# Altium schematic sheet PrototipoBotaoSchDoc.SchDoc
size A4; SheetNumber: 1; SheetTotal: 2
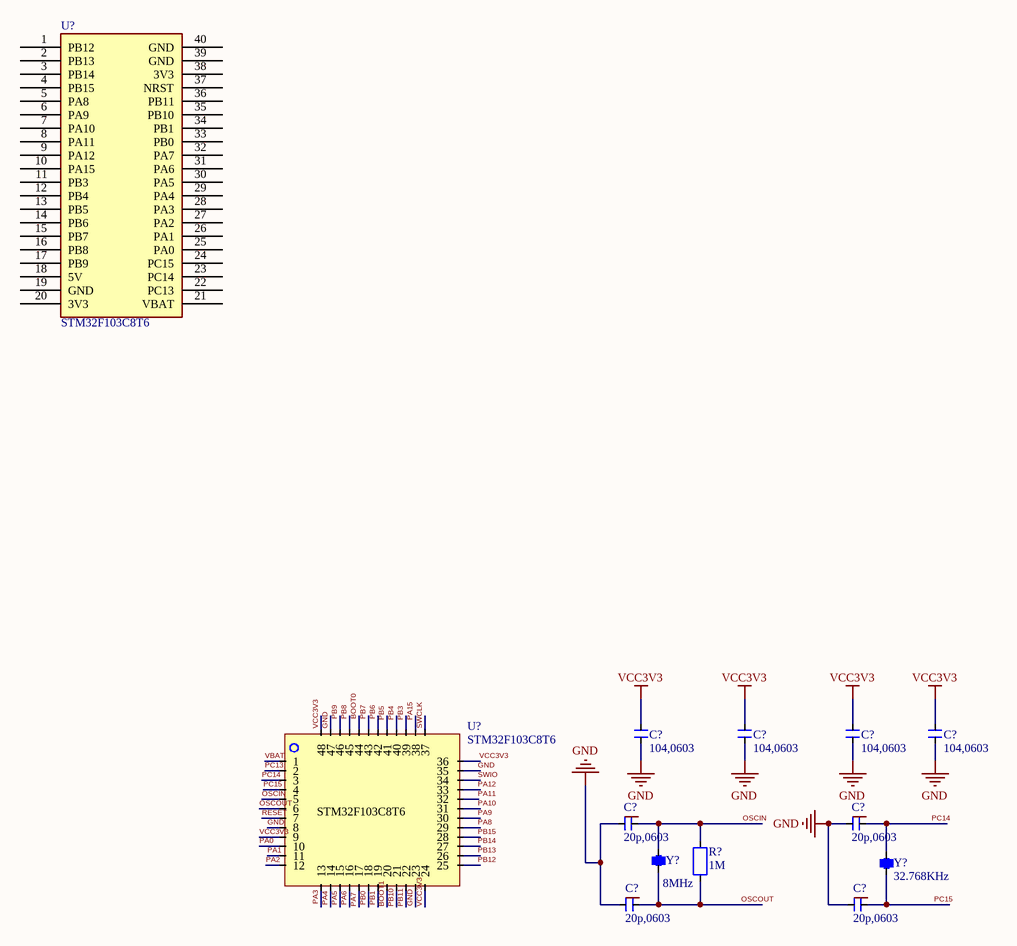
[diagram p0: PrototipoBotaoSchDoc.SchDoc]

## Parts
(Parts that share a designator on the sheet are numbered #1, #2 ... from top to bottom, then left to right.)
C?#1  104,0603
C?#2  104,0603
C?#3  104,0603
C?#4  104,0603  [C0603]
C?#5  20p,0603  [C0603]
C?#6  20p,0603  [C0603]
C?#7  20p,0603  [C0603]
C?#8  20p,0603  [C0603]
R?  1M  [R0603]
U?#1  STM32F103C8T6  [Stm32 BluePill]
U?#2  STM32F103C8T6  [STM32F103C8T6]
Y?#1  8MHz
Y?#2  32.768KHz

## Nets
GND: C?#1.2 C?#2.2 C?#3.2 C?#4.2 C?#5.2 C?#6.2 C?#7.2 C?#8.2 U?#2.8 U?#2.23 U?#2.35 U?#2.47
VCC3V3: C?#1.1 C?#2.1 C?#3.1 C?#4.1 U?#2.9 U?#2.24 U?#2.36 U?#2.48
BOOT0: U?#2.44
BOOT1: U?#2.20
OSCIN: C?#5.1 R?.2 U?#2.5 Y?#1.1
OSCOUT: C?#7.1 R?.1 U?#2.6 Y?#1.2
PA0: U?#2.10
PA1: U?#2.11
PA2: U?#2.12
PA3: U?#2.13
PA4: U?#2.14
PA5: U?#2.15
PA6: U?#2.16
PA7: U?#2.17
PA8: U?#2.29
PA9: U?#2.30
PA10: U?#2.31
PA11: U?#2.32
PA12: U?#2.33
PA15: U?#2.38
PB0: U?#2.18
PB1: U?#2.19
PB3: U?#2.39
PB4: U?#2.40
PB5: U?#2.41
PB6: U?#2.42
PB7: U?#2.43
PB8: U?#2.45
PB9: U?#2.46
PB10: U?#2.21
PB11: U?#2.22
PB12: U?#2.25
PB13: U?#2.26
PB14: U?#2.27
PB15: U?#2.28
PC13: U?#2.2
PC14: C?#6.1 U?#2.3 Y?#2.1
PC15: C?#8.1 U?#2.4 Y?#2.2
RESET: U?#2.7
SWCLK: U?#2.37
SWIO: U?#2.34
VBAT: U?#2.1

Not connected (* = marked no-connect by the designer): U?#1 1(PB12) 2(PB13) 3(PB14) 4(PB15) 5(PA8) 6(PA9) 7(PA10) 8(PA11) 9(PA12) 10(PA15) 11(PB3) 12(PB4) 13(PB5) 14(PB6) 15(PB7) 16(PB8) 17(PB9) 18(5V) 19(GND) 20(3V3) 21(VBAT) 22(PC13) 23(PC14) 24(PC15) 25(PA0) 26(PA1) 27(PA2) 28(PA3) 29(PA4) 30(PA5) 31(PA6) 32(PA7) 33(PB0) 34(PB1) 35(PB10) 36(PB11) 37(NRST) 38(3V3) 39(GND) 40(GND)

## Library data of the parts
C?#1-C?#4 = GRM033C71C104KE14D: 16V 100nF X7S ±10% 0201 Multilayer Ceramic Capacitors MLCC - SMD/SMT ROHS; Manufacturer: Murata; Manufacturer Lifecycle Status: IN PRODUCTION; Supplier 1: Avnet; Supplier Part Number 1: GRM033C71C104KE14D; Manufacturer Part Number: GRM033C71C104KE14D; RoHS: Compliant; Category: Ceramic Capacitors; Stock 1: 960000; Pricing 1: 15000=0,00312, 30000=0,00304, 60000=0,003, 90000=0,00294, 120000=0,00293 (USD); Capacitance: 100nF; Case/Package: 0201; Case Code (Imperial): 0201; Case Code (Metric): 0603; Dielectric: X7S; Dielectric Material: Ceramic; Height: 300µm; Length: 600µm; Lifecycle Status: Production; Material: Ceramic; Max Operating Temperature: 125°C; Min Operating Temperature: -55°C; Mount: Surface Mount; Number of Terminals: 2; Packaging: Digi-Reel®; REACH SVHC: Yes; Schedule B: 8532240020, 8532240020|8532240020, 8532240020|8532240020|8532240020, 8532240020|8532240020|8532240020|8532240020; Termination: SMD/SMT; Thickness: 300µm; Tolerance: 10%; Voltage Rating: 16V; Voltage Rating (DC): 16V; Weight: 340.194278µg; Width: 300µm; ComponentLink1URL: https://datasheet.octopart.com:443/GRM033C71C104KE14D-Murata-datasheet-178521774.pdf?src-supplier=Arrow.cn; ComponentLink1Description: https://datasheet.octopart.com:443/GRM033C71C104KE14D-Murata-datasheet-178521774.pdf?src-supplier=Arrow.cn; ComponentLink2URL: https://datasheet.octopart.com:443/GRM033C71C104KE14D-Murata-datasheet-150009099.pdf?src-supplier=Arrow.cn; ComponentLink2Description: https://datasheet.octopart.com:443/GRM033C71C104KE14D-Murata-datasheet-150009099.pdf?src-supplier=Arrow.cn; ComponentLink3URL: https://datasheet.octopart.com:443/GRM033C71C104KE14D-Murata-datasheet-165579666.pdf?src-supplier=TME; ComponentLink3Description: https://datasheet.octopart.com:443/GRM033C71C104KE14D-Murata-datasheet-165579666.pdf?src-supplier=TME; ComponentLink4URL: https://datasheet.octopart.com:443/GRM033C71C104KE14D-Murata-datasheet-141274204.pdf?src-supplier=Ciiva; ComponentLink4Description: https://datasheet.octopart.com:443/GRM033C71C104KE14D-Murata-datasheet-141274204.pdf?src-supplier=Ciiva; ComponentLink5URL: https://datasheet.octopart.com:443/GRM033C71C104KE14D-Murata-datasheet-140675366.pdf?src-supplier=Ciiva; ComponentLink5Description: https://datasheet.octopart.com:443/GRM033C71C104KE14D-Murata-datasheet-140675366.pdf?src-supplier=Ciiva; ComponentLink6URL: https://datasheet.octopart.com:443/GRM033C71C104KE14D-Murata-datasheet-138738157.pdf?src-supplier=Ciiva; ComponentLink6Description: https://datasheet.octopart.com:443/GRM033C71C104KE14D-Murata-datasheet-138738157.pdf?src-supplier=Ciiva; ComponentLink7URL: https://datasheet.octopart.com:443/GRM033C71C104KE14D-Murata-datasheet-22122223.pdf?src-supplier=Future+Electronics; ComponentLink7Description: https://datasheet.octopart.com:443/GRM033C71C104KE14D-Murata-datasheet-22122223.pdf?src-supplier=Future+Electronics; ComponentLink8URL: https://datasheet.octopart.com/GRM033C71C104KE14D-Murata-datasheet-12515295.pdf; ComponentLink8Description: https://datasheet.octopart.com/GRM033C71C104KE14D-Murata-datasheet-12515295.pdf; ComponentLink9URL: https://datasheet.octopart.com/GRM033C71C104KE14D-Murata-datasheet-12510076.pdf; ComponentLink9Description: https://datasheet.octopart.com/GRM033C71C104KE14D-Murata-datasheet-12510076.pdf; ComponentLink10URL: https://datasheet.octopart.com/GRM033C71C104KE14D-Murata-datasheet-11978611.pdf; ComponentLink10Description: https://datasheet.octopart.com/GRM033C71C104KE14D-Murata-datasheet-11978611.pdf; ComponentLink11URL: https://datasheet.octopart.com/GRM033C71C104KE14D-Murata-datasheet-10025737.pdf; ComponentLink11Description: https://datasheet.octopart.com/GRM033C71C104KE14D-Murata-datasheet-10025737.pdf; ComponentLink12URL: https://datasheet.octopart.com/GRM033C71C104KE14D-Murata-datasheet-8819587.pdf; ComponentLink12Description: https://datasheet.octopart.com/GRM033C71C104KE14D-Murata-datasheet-8819587.pdf; ComponentLink13URL: http://sigma.octopart.com:80/reach_statement/Murata-company-16.pdf?src-supplier=Compliance+Statements; ComponentLink13Description: http://sigma.octopart.com:80/reach_statement/Murata-company-16.pdf?src-supplier=Compliance+Statements
C?#5-C?#8 = Capacitor: Capacitor 0603; Manufacturer: Murata; Manufacturer Part Number: GRM033C71C104KE14D; Manufacturer Lifecycle Status: IN PRODUCTION; Capacitance: 100nF; Dielectric: X7S; Dielectric Material: Ceramic; Tolerance: 10%; Voltage Rating: 16V; Supplier 1: Avnet; Supplier Part Number 1: GRM033C71C104KE14D; RoHS: Compliant; Category: Ceramic Capacitors; Stock 1: 960000; Pricing 1: 15000=0,00312, 30000=0,00304, 60000=0,003, 90000=0,00294, 120000=0,00293 (USD); Case/Package: 0201; Case Code (Imperial): 0201; Case Code (Metric): 0603; Height: 300µm; Length: 600µm; Lifecycle Status: Production; Material: Ceramic; Max Operating Temperature: 125°C; Min Operating Temperature: -55°C; Mount: Surface Mount; Number of Terminals: 2; Packaging: Digi-Reel®; REACH SVHC: Yes; Schedule B: 8532240020, 8532240020|8532240020, 8532240020|8532240020|8532240020, 8532240020|8532240020|8532240020|8532240020; Termination: SMD/SMT; Thickness: 300µm; Voltage Rating (DC): 16V; Weight: 340.194278µg; Width: 300µm; ComponentLink1URL: https://datasheet.octopart.com:443/GRM033C71C104KE14D-Murata-datasheet-178521774.pdf?src-supplier=Arrow.cn; ComponentLink1Description: https://datasheet.octopart.com:443/GRM033C71C104KE14D-Murata-datasheet-178521774.pdf?src-supplier=Arrow.cn; ComponentLink2URL: https://datasheet.octopart.com:443/GRM033C71C104KE14D-Murata-datasheet-150009099.pdf?src-supplier=Arrow.cn; ComponentLink2Description: https://datasheet.octopart.com:443/GRM033C71C104KE14D-Murata-datasheet-150009099.pdf?src-supplier=Arrow.cn; ComponentLink3URL: https://datasheet.octopart.com:443/GRM033C71C104KE14D-Murata-datasheet-165579666.pdf?src-supplier=TME; ComponentLink3Description: https://datasheet.octopart.com:443/GRM033C71C104KE14D-Murata-datasheet-165579666.pdf?src-supplier=TME; ComponentLink4URL: https://datasheet.octopart.com:443/GRM033C71C104KE14D-Murata-datasheet-141274204.pdf?src-supplier=Ciiva; ComponentLink4Description: https://datasheet.octopart.com:443/GRM033C71C104KE14D-Murata-datasheet-141274204.pdf?src-supplier=Ciiva; ComponentLink5URL: https://datasheet.octopart.com:443/GRM033C71C104KE14D-Murata-datasheet-140675366.pdf?src-supplier=Ciiva; ComponentLink5Description: https://datasheet.octopart.com:443/GRM033C71C104KE14D-Murata-datasheet-140675366.pdf?src-supplier=Ciiva; ComponentLink6URL: https://datasheet.octopart.com:443/GRM033C71C104KE14D-Murata-datasheet-138738157.pdf?src-supplier=Ciiva; ComponentLink6Description: https://datasheet.octopart.com:443/GRM033C71C104KE14D-Murata-datasheet-138738157.pdf?src-supplier=Ciiva; ComponentLink7URL: https://datasheet.octopart.com:443/GRM033C71C104KE14D-Murata-datasheet-22122223.pdf?src-supplier=Future+Electronics; ComponentLink7Description: https://datasheet.octopart.com:443/GRM033C71C104KE14D-Murata-datasheet-22122223.pdf?src-supplier=Future+Electronics; ComponentLink8URL: https://datasheet.octopart.com/GRM033C71C104KE14D-Murata-datasheet-12515295.pdf; ComponentLink8Description: https://datasheet.octopart.com/GRM033C71C104KE14D-Murata-datasheet-12515295.pdf; ComponentLink9URL: https://datasheet.octopart.com/GRM033C71C104KE14D-Murata-datasheet-12510076.pdf; ComponentLink9Description: https://datasheet.octopart.com/GRM033C71C104KE14D-Murata-datasheet-12510076.pdf; ComponentLink10URL: https://datasheet.octopart.com/GRM033C71C104KE14D-Murata-datasheet-11978611.pdf; ComponentLink10Description: https://datasheet.octopart.com/GRM033C71C104KE14D-Murata-datasheet-11978611.pdf; ComponentLink11URL: https://datasheet.octopart.com/GRM033C71C104KE14D-Murata-datasheet-10025737.pdf; ComponentLink11Description: https://datasheet.octopart.com/GRM033C71C104KE14D-Murata-datasheet-10025737.pdf; ComponentLink12URL: https://datasheet.octopart.com/GRM033C71C104KE14D-Murata-datasheet-8819587.pdf; ComponentLink12Description: https://datasheet.octopart.com/GRM033C71C104KE14D-Murata-datasheet-8819587.pdf; ComponentLink13URL: http://sigma.octopart.com:80/reach_statement/Murata-company-16.pdf?src-supplier=Compliance+Statements; ComponentLink13Description: http://sigma.octopart.com:80/reach_statement/Murata-company-16.pdf?src-supplier=Compliance+Statements
R? = Resistor: Resistor 0603; Manufacturer: Vishay; Manufacturer Part Number: CRCW060347K0FKEAHP; Max Power Dissipation: 250mW; Power Dissipation: 330mW; Resistance: 47kΩ; Temperature Coefficient: 100ppm/°C; Tolerance: 1%; Voltage Rating: 75V; Supplier 1: Avnet; Supplier Part Number 1: CRCW060347K0FKEAHP; RoHS: Compliant; Category: Chip SMD Resistors; Stock 1: 40000; Pricing 1: 5000=0,01375, 10000=0,01363, 20000=0,01248, 30000=0,01226, 40000=0,01205 (USD); Case/Package: 0603; Case Code (Imperial): 0603; Case Code (Metric): 1608; China RoHS: Non-Compliant; Composition: Thick Film; Contact Plating: Tin; Depth: 850µm; Features: Automotive AEC-Q200; Height: 450µm; Lead Free: Lead Free; Length: 1.6mm; Lifecycle Status: Production; Max Operating Temperature: 155°C; Military Standard: Not; Min Operating Temperature: -55°C; Mount: Surface Mount; Number of Pins: 2; Number of Terminals: 2; Number of Terminations: 2; Packaging: Cut Tape; Power Rating: 330mW; Radiation Hardening: No; REACH SVHC: Yes; Schedule B: 8533210045, 8533210045|8533210045, 8533210045|8533210045|8533210045, 8533210045|8533210045|8533210045|8533210045; Termination: SMD/SMT; Voltage Rating (DC): 75V; Weight: 2.012816mg; Width: 850µm; Working Voltage: 75V; ComponentLink1URL: https://datasheet.octopart.com:443/CRCW060347K0FKEAHP-Vishay-datasheet-13148866.pdf?src-supplier=Upverter; ComponentLink1Description: https://datasheet.octopart.com:443/CRCW060347K0FKEAHP-Vishay-datasheet-13148866.pdf?src-supplier=Upverter; ComponentLink2URL: https://datasheet.octopart.com:443/CRCW060347K0FKEAHP-Vishay-datasheet-13131392.pdf?src-supplier=Upverter; ComponentLink2Description: https://datasheet.octopart.com:443/CRCW060347K0FKEAHP-Vishay-datasheet-13131392.pdf?src-supplier=Upverter; ComponentLink3URL: https://datasheet.octopart.com:443/CRCW060347K0FKEAHP-Vishay-datasheet-12593106.pdf?src-supplier=Upverter; ComponentLink3Description: https://datasheet.octopart.com:443/CRCW060347K0FKEAHP-Vishay-datasheet-12593106.pdf?src-supplier=Upverter; ComponentLink4URL: https://datasheet.octopart.com:443/CRCW060347K0FKEAHP-Vishay-datasheet-12544674.pdf?src-supplier=Upverter; ComponentLink4Description: https://datasheet.octopart.com:443/CRCW060347K0FKEAHP-Vishay-datasheet-12544674.pdf?src-supplier=Upverter; ComponentLink5URL: https://datasheet.octopart.com:443/CRCW060347K0FKEAHP-Vishay-datasheet-12531795.pdf?src-supplier=Upverter; ComponentLink5Description: https://datasheet.octopart.com:443/CRCW060347K0FKEAHP-Vishay-datasheet-12531795.pdf?src-supplier=Upverter; ComponentLink6URL: https://datasheet.octopart.com:443/CRCW060347K0FKEAHP-Vishay-datasheet-12518686.pdf?src-supplier=Upverter; ComponentLink6Description: https://datasheet.octopart.com:443/CRCW060347K0FKEAHP-Vishay-datasheet-12518686.pdf?src-supplier=Upverter; ComponentLink7URL: https://datasheet.octopart.com:443/CRCW060347K0FKEAHP-Vishay-datasheet-12509906.pdf?src-supplier=Upverter; ComponentLink7Description: https://datasheet.octopart.com:443/CRCW060347K0FKEAHP-Vishay-datasheet-12509906.pdf?src-supplier=Upverter; ComponentLink8URL: https://datasheet.octopart.com:443/CRCW060347K0FKEAHP-Vishay-datasheet-10669844.pdf?src-supplier=Upverter; ComponentLink8Description: https://datasheet.octopart.com:443/CRCW060347K0FKEAHP-Vishay-datasheet-10669844.pdf?src-supplier=Upverter; ComponentLink9URL: https://datasheet.octopart.com:443/CRCW060347K0FKEAHP-Vishay-datasheet-8703221.pdf?src-supplier=Upverter; ComponentLink9Description: https://datasheet.octopart.com:443/CRCW060347K0FKEAHP-Vishay-datasheet-8703221.pdf?src-supplier=Upverter; ComponentLink10URL: https://datasheet.octopart.com:443/CRCW060347K0FKEAHP-Vishay-datasheet-87136057.pdf?src-supplier=Newark; ComponentLink10Description: https://datasheet.octopart.com:443/CRCW060347K0FKEAHP-Vishay-datasheet-87136057.pdf?src-supplier=Newark; ComponentLink11URL: https://datasheet.octopart.com:443/CRCW060347K0FKEAHP-Vishay-datasheet-66581887.pdf?src-supplier=Newark; ComponentLink11Description: https://datasheet.octopart.com:443/CRCW060347K0FKEAHP-Vishay-datasheet-66581887.pdf?src-supplier=Newark; ComponentLink12URL: https://datasheet.octopart.com:443/CRCW060347K0FKEAHP-Vishay-datasheet-37143532.pdf?src-supplier=Newark; ComponentLink12Description: https://datasheet.octopart.com:443/CRCW060347K0FKEAHP-Vishay-datasheet-37143532.pdf?src-supplier=Newark; ComponentLink13URL: https://datasheet.octopart.com:443/CRCW060347K0FKEAHP-Vishay-datasheet-8359436.pdf?src-supplier=Newark; ComponentLink13Description: https://datasheet.octopart.com:443/CRCW060347K0FKEAHP-Vishay-datasheet-8359436.pdf?src-supplier=Newark; ComponentLink14URL: https://datasheet.octopart.com:443/CRCW060347K0FKEAHP-Vishay-datasheet-62317937.pdf?src-supplier=element14+APAC; ComponentLink14Description: https://datasheet.octopart.com:443/CRCW060347K0FKEAHP-Vishay-datasheet-62317937.pdf?src-supplier=element14+APAC; ComponentLink15URL: https://datasheet.octopart.com/CRCW060347K0FKEAHP-Vishay-datasheet-83567917.pdf; ComponentLink15Description: https://datasheet.octopart.com/CRCW060347K0FKEAHP-Vishay-datasheet-83567917.pdf; ComponentLink16URL: https://datasheet.octopart.com:443/CRCW060347K0FKEAHP-Vishay-Dale-datasheet-47688881.pdf?src-supplier=RS+(Formerly+Allied+Electronics); ComponentLink16Description: https://datasheet.octopart.com:443/CRCW060347K0FKEAHP-Vishay-Dale-datasheet-47688881.pdf?src-supplier=RS+(Formerly+Allied+Electronics); ComponentLink17URL: http://sigma.octopart.com:80/rohs_statement/Vishay-company-15.pdf?src-supplier=Compliance+Statements; ComponentLink17Description: http://sigma.octopart.com:80/rohs_statement/Vishay-company-15.pdf?src-supplier=Compliance+Statements
U?#1 = BluePill: Designed By @Alixahedi
U?#2 = STM32F103C8T6: MCU 32-bit STM32F1 ARM Cortex M3 RISC 64KB Flash 2.5V/3.3V 48-Pin LQFP Tray; Manufacturer: STMicroelectronics; Manufacturer Package Identifier: ai14911d; Address Bus Width: 32b; Clock Rate: 16MHz; Density: 512kb; EEPROM Memory Size: 0B; Frequency: 72MHz; Interface: CAN, USB; Max Power Dissipation: 363mW; Max Supply Current: 50mA; Max Supply Voltage: 3.6V; Min Supply Voltage: 2V; Nominal Supply Current: 1.7µA; Number of A/D Converters: 2; Number of ADC Channels: 10; Number of Bits: 32; Number of I/Os: 37; Number of Interrupts: 16; Number of Programmable I/O: 48; Number of PWM Channels: 1; Number of Timers/Counters: 4; Number of USART Channels: 3; Operating Supply Voltage: 3.3V; Oscillator Type: Internal; Peripherals: DMA, I2C, POR, PWM, Temp Sensor, WDT; RAM Size: 20kB; Watchdog Timer: Yes; Categoria: Microcontroladores; Supplier 1: Avnet; Supplier Part Number 1: 59M2182; Manufacturer Part Number: STM32F103C8T6; RoHS: Compliant; Category: Microcontrollers; Stock 1: 53605; Pricing 1: 1=5,5, 10=4,59, 25=3,91, 100=3,9, 250=3,67 (USD); Case/Package: LQFP; China RoHS: Compliant; Core Architecture: ARM; Data Bus Width: 32b; Flash Memory Size: 64kB; Height: 1.45mm; Height - Seated (Max): 1.6mm; Lead Free: Lead Free; Length: 7mm; Lifecycle Status: Production; Max Frequency: 72MHz; Max Operating Temperature: 85°C; Memory Size: 64kB; Memory Type: FLASH; Min Operating Temperature: -40°C; Mount: Surface Mount; Number of Channels: 10; Number of I2C Channels: 2; Number of Pins: 48; Number of SPI Channels: 2; Number of Terminals: 48; Radiation Hardening: No; REACH SVHC: Yes; Schedule B: 8542310000; Terminal Pitch: 500µm; Termination: SMD/SMT; Width: 7mm; ComponentLink1URL: https://datasheet.octopart.com:443/STM32F103C8T6-STMicroelectronics-datasheet-48026265.pdf?src-supplier=ICpick; ComponentLink1Description: https://datasheet.octopart.com:443/STM32F103C8T6-STMicroelectronics-datasheet-48026265.pdf?src-supplier=ICpick; ComponentLink2URL: https://datasheet.octopart.com:443/STM32F103C8T6-STMicroelectronics-datasheet-10330614.pdf?src-supplier=Newark; ComponentLink2Description: https://datasheet.octopart.com:443/STM32F103C8T6-STMicroelectronics-datasheet-10330614.pdf?src-supplier=Newark; ComponentLink3URL: https://datasheet.octopart.com:443/STM32F103C8T6-STMicroelectronics-datasheet-16839800.pdf?src-supplier=Newark; ComponentLink3Description: https://datasheet.octopart.com:443/STM32F103C8T6-STMicroelectronics-datasheet-16839800.pdf?src-supplier=Newark; ComponentLink4URL: https://datasheet.octopart.com:443/STM32F103C8T6-STMicroelectronics-datasheet-14363502.pdf?src-supplier=Farnell; ComponentLink4Description: https://datasheet.octopart.com:443/STM32F103C8T6-STMicroelectronics-datasheet-14363502.pdf?src-supplier=Farnell; ComponentLink5URL: https://datasheet.octopart.com:443/STM32F103C8T6-STMicroelectronics-datasheet-500013.pdf?src-supplier=Farnell; ComponentLink5Description: https://datasheet.octopart.com:443/STM32F103C8T6-STMicroelectronics-datasheet-500013.pdf?src-supplier=Farnell; ComponentLink6URL: https://datasheet.octopart.com:443/STM32F103C8T6-STMicroelectronics-datasheet-8365036.pdf?src-supplier=Farnell; ComponentLink6Description: https://datasheet.octopart.com:443/STM32F103C8T6-STMicroelectronics-datasheet-8365036.pdf?src-supplier=Farnell; ComponentLink7URL: https://datasheet.octopart.com:443/STM32F103C8T6-STMicroelectronics-datasheet-6396519.pdf?src-supplier=Verical; ComponentLink7Description: https://datasheet.octopart.com:443/STM32F103C8T6-STMicroelectronics-datasheet-6396519.pdf?src-supplier=Verical; ComponentLink8URL: https://datasheet.octopart.com:443/STM32F103C8T6-STMicroelectronics-datasheet-21407612.pdf?src-supplier=element14+APAC; ComponentLink8Description: https://datasheet.octopart.com:443/STM32F103C8T6-STMicroelectronics-datasheet-21407612.pdf?src-supplier=element14+APAC; ComponentLink9URL: https://datasheet.octopart.com:443/STM32F103C8T6-STMicroelectronics-datasheet-8700640.pdf?src-supplier=element14; ComponentLink9Description: https://datasheet.octopart.com:443/STM32F103C8T6-STMicroelectronics-datasheet-8700640.pdf?src-supplier=element14; ComponentLink10URL: https://datasheet.octopart.com:443/STM32F103C8T6-STMicroelectronics-datasheet-177520228.pdf?src-supplier=Burklin+Elektronik; ComponentLink10Description: https://datasheet.octopart.com:443/STM32F103C8T6-STMicroelectronics-datasheet-177520228.pdf?src-supplier=Burklin+Elektronik; ComponentLink11URL: https://datasheet.octopart.com:443/STM32F103C8T6-STMicroelectronics-datasheet-165583531.pdf?src-supplier=SOS+electronic; ComponentLink11Description: https://datasheet.octopart.com:443/STM32F103C8T6-STMicroelectronics-datasheet-165583531.pdf?src-supplier=SOS+electronic; ComponentLink12URL: https://datasheet.octopart.com:443/STM32F103C8T6-STMicroelectronics-datasheet-14106722.pdf?src-supplier=iiiC; ComponentLink12Description: https://datasheet.octopart.com:443/STM32F103C8T6-STMicroelectronics-datasheet-14106722.pdf?src-supplier=iiiC; ComponentLink13URL: https://datasheet.octopart.com:443/STM32F103C8T6-STMicroelectronics-datasheet-17594274.pdf?src-supplier=TME; ComponentLink13Description: https://datasheet.octopart.com:443/STM32F103C8T6-STMicroelectronics-datasheet-17594274.pdf?src-supplier=TME; ComponentLink14URL: https://datasheet.octopart.com:443/STM32F103C8T6-STMicroelectronics-datasheet-148251.pdf?src-supplier=Nu+Horizons; ComponentLink14Description: https://datasheet.octopart.com:443/STM32F103C8T6-STMicroelectronics-datasheet-148251.pdf?src-supplier=Nu+Horizons
Y?#1 = Crystal Clock: Manufacturer: Abracon; Manufacturer Part Number: ASE-8.000MHZ-L-C-T; Fall Time: 4ns; Frequency Stability: 50ppm; Load Capacitance: 15pF; Max Supply Current: 7mA; Max Supply Voltage: 3.465V; Min Supply Voltage: 3.135V; Operating Supply Voltage: 3.3V; Supplier 1: Avnet; Supplier Part Number 1: ASE-8.000MHZ-L-C-T; RoHS: Compliant; Category: Crystals; Stock 1: 25000; Pricing 1: 1000=0,705, 2000=0,699, 4000=0,687, 6000=0,61875, 8000=0,60775 (USD); China RoHS: Compliant; Frequency: 8MHz; Lifecycle Status: Production; Max Operating Temperature: 85°C; Min Operating Temperature: -40°C; Mount: Surface Mount; Number of Terminals: 4; REACH SVHC: Yes; Rise Time: 4ns; ComponentLink1URL: https://datasheet.octopart.com:443/ASE-8.000MHZ-L-C-T-Abracon-datasheet-170668568.pdf?src-supplier=IHS; ComponentLink1Description: https://datasheet.octopart.com:443/ASE-8.000MHZ-L-C-T-Abracon-datasheet-170668568.pdf?src-supplier=IHS; ComponentLink2URL: https://datasheet.octopart.com:443/ASE-8.000MHZ-L-C-T-Abracon-datasheet-37142403.pdf?src-supplier=JRH+Electronics; ComponentLink2Description: https://datasheet.octopart.com:443/ASE-8.000MHZ-L-C-T-Abracon-datasheet-37142403.pdf?src-supplier=JRH+Electronics; ComponentLink3URL: https://datasheet.octopart.com:443/ASE-8.000MHZ-L-C-T-Abracon-datasheet-12511647.pdf?src-supplier=Newark; ComponentLink3Description: https://datasheet.octopart.com:443/ASE-8.000MHZ-L-C-T-Abracon-datasheet-12511647.pdf?src-supplier=Newark; ComponentLink4URL: https://datasheet.octopart.com:443/ASE-8.000MHZ-L-C-T-Abracon-datasheet-8824718.pdf?src-supplier=Newark; ComponentLink4Description: https://datasheet.octopart.com:443/ASE-8.000MHZ-L-C-T-Abracon-datasheet-8824718.pdf?src-supplier=Newark; ComponentLink5URL: https://datasheet.octopart.com:443/ASE-8.000MHZ-L-C-T-Abracon-datasheet-7576246.pdf?src-supplier=Newark; ComponentLink5Description: https://datasheet.octopart.com:443/ASE-8.000MHZ-L-C-T-Abracon-datasheet-7576246.pdf?src-supplier=Newark; ComponentLink6URL: http://sigma.octopart.com:80/conflict_mineral_statement/Abracon-company-27.pdf?src-supplier=Compliance+Statements; ComponentLink6Description: http://sigma.octopart.com:80/conflict_mineral_statement/Abracon-company-27.pdf?src-supplier=Compliance+Statements
Y?#2 = Crystal Clock: Manufacturer: Abracon; Manufacturer Part Number: ASE-8.000MHZ-L-C-T; Fall Time: 4ns; Frequency: 8MHz; Frequency Stability: 50ppm; Load Capacitance: 15pF; Max Supply Current: 7mA; Max Supply Voltage: 3.465V; Min Supply Voltage: 3.135V; Operating Supply Voltage: 3.3V; Supplier 1: Avnet; Supplier Part Number 1: ASE-8.000MHZ-L-C-T; RoHS: Compliant; Category: Crystals; Stock 1: 25000; Pricing 1: 1000=0,705, 2000=0,699, 4000=0,687, 6000=0,61875, 8000=0,60775 (USD); China RoHS: Compliant; Lifecycle Status: Production; Max Operating Temperature: 85°C; Min Operating Temperature: -40°C; Mount: Surface Mount; Number of Terminals: 4; REACH SVHC: Yes; Rise Time: 4ns; ComponentLink1URL: https://datasheet.octopart.com:443/ASE-8.000MHZ-L-C-T-Abracon-datasheet-170668568.pdf?src-supplier=IHS; ComponentLink1Description: https://datasheet.octopart.com:443/ASE-8.000MHZ-L-C-T-Abracon-datasheet-170668568.pdf?src-supplier=IHS; ComponentLink2URL: https://datasheet.octopart.com:443/ASE-8.000MHZ-L-C-T-Abracon-datasheet-37142403.pdf?src-supplier=JRH+Electronics; ComponentLink2Description: https://datasheet.octopart.com:443/ASE-8.000MHZ-L-C-T-Abracon-datasheet-37142403.pdf?src-supplier=JRH+Electronics; ComponentLink3URL: https://datasheet.octopart.com:443/ASE-8.000MHZ-L-C-T-Abracon-datasheet-12511647.pdf?src-supplier=Newark; ComponentLink3Description: https://datasheet.octopart.com:443/ASE-8.000MHZ-L-C-T-Abracon-datasheet-12511647.pdf?src-supplier=Newark; ComponentLink4URL: https://datasheet.octopart.com:443/ASE-8.000MHZ-L-C-T-Abracon-datasheet-8824718.pdf?src-supplier=Newark; ComponentLink4Description: https://datasheet.octopart.com:443/ASE-8.000MHZ-L-C-T-Abracon-datasheet-8824718.pdf?src-supplier=Newark; ComponentLink5URL: https://datasheet.octopart.com:443/ASE-8.000MHZ-L-C-T-Abracon-datasheet-7576246.pdf?src-supplier=Newark; ComponentLink5Description: https://datasheet.octopart.com:443/ASE-8.000MHZ-L-C-T-Abracon-datasheet-7576246.pdf?src-supplier=Newark; ComponentLink6URL: http://sigma.octopart.com:80/conflict_mineral_statement/Abracon-company-27.pdf?src-supplier=Compliance+Statements; ComponentLink6Description: http://sigma.octopart.com:80/conflict_mineral_statement/Abracon-company-27.pdf?src-supplier=Compliance+Statements